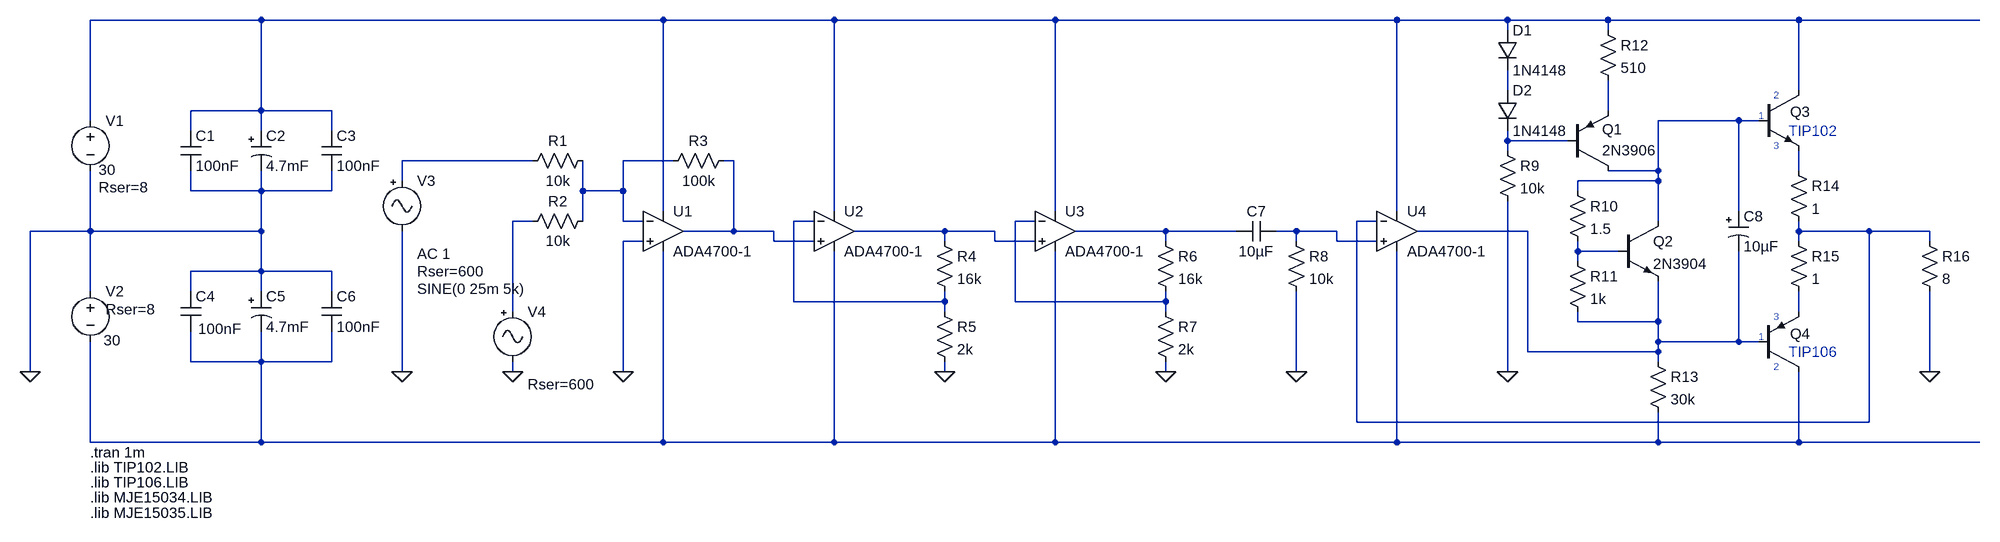
[diagram p0: schematic 30Vamp.asc]
30Vamp.asc, the LTspice schematic file:
Version 4
SHEET 1 3496 808
WIRE 464 -192 192 -192
WIRE 1104 -192 464 -192
WIRE 1376 -192 1104 -192
WIRE 1728 -192 1376 -192
WIRE 2272 -192 1728 -192
WIRE 2448 -192 2272 -192
WIRE 2608 -192 2448 -192
WIRE 2912 -192 2608 -192
WIRE 3200 -192 2912 -192
WIRE 2448 -176 2448 -192
WIRE 2608 -176 2608 -192
WIRE 2448 -80 2448 -112
WIRE 2912 -80 2912 -192
WIRE 464 -48 464 -192
WIRE 464 -48 352 -48
WIRE 576 -48 464 -48
WIRE 2608 -48 2608 -96
WIRE 192 -32 192 -192
WIRE 2816 -32 2688 -32
WIRE 2848 -32 2816 -32
WIRE 352 -16 352 -48
WIRE 464 -16 464 -48
WIRE 576 -16 576 -48
WIRE 2448 0 2448 -16
WIRE 2544 0 2448 0
WIRE 2448 16 2448 0
WIRE 896 32 688 32
WIRE 1120 32 1040 32
WIRE 1216 32 1200 32
WIRE 2688 48 2688 -32
WIRE 2688 48 2608 48
WIRE 2912 48 2912 16
WIRE 688 64 688 32
WIRE 2688 64 2688 48
WIRE 2688 64 2560 64
WIRE 352 80 352 48
WIRE 464 80 464 48
WIRE 464 80 352 80
WIRE 576 80 576 48
WIRE 576 80 464 80
WIRE 976 80 976 32
WIRE 1040 80 1040 32
WIRE 1040 80 976 80
WIRE 2560 80 2560 64
WIRE 1104 112 1104 -192
WIRE 1376 112 1376 -192
WIRE 1728 112 1728 -192
WIRE 2272 112 2272 -192
WIRE 2816 112 2816 -32
WIRE 896 128 864 128
WIRE 976 128 976 80
WIRE 1040 128 1040 80
WIRE 1072 128 1040 128
WIRE 1344 128 1312 128
WIRE 1696 128 1664 128
WIRE 2240 128 2208 128
WIRE 2688 128 2688 64
WIRE 192 144 192 48
WIRE 192 144 96 144
WIRE 464 144 464 80
WIRE 464 144 192 144
WIRE 1216 144 1216 32
WIRE 1216 144 1136 144
WIRE 1280 144 1216 144
WIRE 1552 144 1408 144
WIRE 1632 144 1552 144
WIRE 1904 144 1760 144
WIRE 2016 144 1904 144
WIRE 2112 144 2080 144
WIRE 2176 144 2112 144
WIRE 2480 144 2304 144
WIRE 2912 144 2912 128
WIRE 3024 144 2912 144
WIRE 3120 144 3024 144
WIRE 1072 160 1040 160
WIRE 1280 160 1280 144
WIRE 1344 160 1280 160
WIRE 1552 160 1552 144
WIRE 1632 160 1632 144
WIRE 1696 160 1632 160
WIRE 1904 160 1904 144
WIRE 2112 160 2112 144
WIRE 2176 160 2176 144
WIRE 2240 160 2176 160
WIRE 2912 160 2912 144
WIRE 3120 160 3120 144
WIRE 2560 176 2560 160
WIRE 2624 176 2560 176
WIRE 2560 192 2560 176
WIRE 464 208 464 144
WIRE 464 208 352 208
WIRE 576 208 464 208
WIRE 192 240 192 144
WIRE 352 240 352 208
WIRE 464 240 464 208
WIRE 576 240 576 208
WIRE 1312 256 1312 128
WIRE 1552 256 1552 240
WIRE 1552 256 1312 256
WIRE 1664 256 1664 128
WIRE 1904 256 1904 240
WIRE 1904 256 1664 256
WIRE 864 272 864 128
WIRE 1552 272 1552 256
WIRE 1904 272 1904 256
WIRE 2912 272 2912 240
WIRE 2560 288 2560 272
WIRE 2688 288 2688 224
WIRE 2688 288 2560 288
WIRE 2688 320 2688 288
WIRE 2816 320 2816 176
WIRE 2816 320 2688 320
WIRE 2848 320 2816 320
WIRE 2480 336 2480 144
WIRE 2688 336 2688 320
WIRE 2688 336 2480 336
WIRE 352 352 352 304
WIRE 464 352 464 304
WIRE 464 352 352 352
WIRE 576 352 576 304
WIRE 576 352 464 352
WIRE 2688 352 2688 336
WIRE 96 368 96 144
WIRE 688 368 688 144
WIRE 864 368 864 352
WIRE 1040 368 1040 160
WIRE 1552 368 1552 352
WIRE 1904 368 1904 352
WIRE 2112 368 2112 240
WIRE 2448 368 2448 96
WIRE 3120 368 3120 240
WIRE 2208 448 2208 128
WIRE 3024 448 3024 144
WIRE 3024 448 2208 448
WIRE 192 480 192 320
WIRE 464 480 464 352
WIRE 464 480 192 480
WIRE 1104 480 1104 176
WIRE 1104 480 464 480
WIRE 1376 480 1376 176
WIRE 1376 480 1104 480
WIRE 1728 480 1728 176
WIRE 1728 480 1376 480
WIRE 2272 480 2272 176
WIRE 2272 480 1728 480
WIRE 2688 480 2688 432
WIRE 2688 480 2272 480
WIRE 2912 480 2912 368
WIRE 2912 480 2688 480
WIRE 3200 480 2912 480
FLAG 1904 368 0
FLAG 1552 368 0
FLAG 2112 368 0
FLAG 864 368 0
FLAG 3120 368 0
FLAG 96 368 0
FLAG 2448 368 0
FLAG 1040 368 0
FLAG 688 368 0
SYMBOL voltage 192 -48 R0
WINDOW 3 13 94 Left 2
WINDOW 123 0 0 Left 0
WINDOW 39 13 122 Left 2
SYMATTR Value 30
SYMATTR SpiceLine Rser=8
SYMATTR InstName V1
SYMBOL voltage 192 224 R0
WINDOW 123 0 0 Left 0
WINDOW 39 24 44 Left 2
WINDOW 3 21 94 Left 2
SYMATTR SpiceLine Rser=8
SYMATTR Value 30
SYMATTR InstName V2
SYMBOL cap 336 -16 R0
SYMATTR InstName C1
SYMATTR Value 100nF
SYMBOL cap 560 -16 R0
SYMATTR InstName C3
SYMATTR Value 100nF
SYMBOL cap 336 240 R0
WINDOW 3 28 59 Left 2
SYMATTR Value 100nF
SYMATTR InstName C4
SYMBOL cap 560 240 R0
SYMATTR InstName C6
SYMATTR Value 100nF
SYMBOL polcap 448 -16 R0
SYMATTR InstName C2
SYMATTR Value 4.7mF
SYMBOL polcap 448 240 R0
SYMATTR InstName C5
SYMATTR Value 4.7mF
SYMBOL res 1536 144 R0
SYMATTR InstName R4
SYMATTR Value 16k
SYMBOL res 1536 256 R0
SYMATTR InstName R5
SYMATTR Value 2k
SYMBOL res 1888 144 R0
SYMATTR InstName R6
SYMATTR Value 16k
SYMBOL res 1888 256 R0
SYMATTR InstName R7
SYMATTR Value 2k
SYMBOL cap 2080 128 R90
WINDOW 0 0 32 VBottom 2
WINDOW 3 32 32 VTop 2
SYMATTR InstName C7
SYMATTR Value 10µF
SYMBOL npn 2848 -80 R0
WINDOW 0 50 34 Left 2
WINDOW 3 49 61 Left 2
SYMATTR InstName Q3
SYMATTR Value ""
SYMATTR SpiceModel Qmje15034
SYMBOL pnp 2848 368 M180
WINDOW 0 50 61 Left 2
WINDOW 3 50 34 Left 2
SYMATTR InstName Q4
SYMATTR Value ""
SYMATTR SpiceModel Qmje15035
SYMBOL res 2896 32 R0
SYMATTR InstName R14
SYMATTR Value 1
SYMATTR SpiceLine pwr=5
SYMBOL res 2896 144 R0
SYMATTR InstName R15
SYMATTR Value 1
SYMATTR SpiceLine pwr=5
SYMBOL res 3104 144 R0
SYMATTR InstName R16
SYMATTR Value 8
SYMATTR SpiceLine pwr=5
SYMBOL res 2096 144 R0
SYMATTR InstName R8
SYMATTR Value 10k
SYMBOL npn 2624 128 R0
SYMATTR InstName Q2
SYMATTR Value 2N3904
SYMBOL pnp 2544 48 M180
WINDOW 0 55 66 Left 2
WINDOW 3 55 33 Left 2
SYMATTR InstName Q1
SYMATTR Value 2N3906
SYMBOL res 2544 64 R0
SYMATTR InstName R10
SYMATTR Value 1.5
SYMBOL res 2544 176 R0
SYMATTR InstName R11
SYMATTR Value 1k
SYMBOL polcap 2800 112 R0
SYMATTR InstName C8
SYMATTR Value 10µF
SYMBOL res 2592 -192 R0
SYMATTR InstName R12
SYMATTR Value 510
SYMBOL diode 2432 -176 R0
SYMATTR InstName D1
SYMATTR Value 1N4148
SYMBOL res 2432 0 R0
SYMATTR InstName R9
SYMATTR Value 10k
SYMBOL res 992 16 R90
WINDOW 0 0 56 VBottom 2
WINDOW 3 32 56 VTop 2
SYMATTR InstName R1
SYMATTR Value 10k
SYMBOL res 992 112 R90
WINDOW 0 0 56 VBottom 2
WINDOW 3 32 56 VTop 2
SYMATTR InstName R2
SYMATTR Value 10k
SYMBOL res 1216 16 R90
WINDOW 0 0 56 VBottom 2
WINDOW 3 32 56 VTop 2
SYMATTR InstName R3
SYMATTR Value 100k
SYMBOL diode 2432 -80 R0
SYMATTR InstName D2
SYMATTR Value 1N4148
SYMBOL Misc\\signal 688 48 R0
WINDOW 123 24 132 Left 2
WINDOW 39 24 160 Left 2
WINDOW 3 24 188 Left 2
SYMATTR Value2 AC 1
SYMATTR SpiceLine Rser=600
SYMATTR Value SINE(0 25m 5k)
SYMATTR InstName V3
SYMBOL Misc\\signal 864 256 R0
WINDOW 123 0 0 Left 0
WINDOW 39 24 132 Left 2
WINDOW 3 24 44 Left 2
SYMATTR SpiceLine Rser=600
SYMATTR Value ""
SYMATTR InstName V4
SYMBOL Opamps\\ADA4700-1 1104 80 R0
SYMATTR InstName U1
SYMBOL Opamps\\ADA4700-1 1376 80 R0
SYMATTR InstName U2
SYMBOL Opamps\\ADA4700-1 1728 80 R0
SYMATTR InstName U3
SYMBOL Opamps\\ADA4700-1 2272 80 R0
SYMATTR InstName U4
SYMBOL res 2672 336 R0
SYMATTR InstName R13
SYMATTR Value 30k
TEXT 2848 -40 Left 1 ;1
TEXT 2872 -72 Left 1 ;2
TEXT 2872 8 Left 1 ;3
TEXT 2848 312 Left 1 ;1
TEXT 2872 280 Left 1 ;3
TEXT 2872 360 Left 1 ;2
TEXT 192 520 Left 2 !.lib TIP102.LIB
TEXT 192 544 Left 2 !.lib TIP106.LIB
TEXT 192 496 Left 2 !.tran 1m
TEXT 192 568 Left 2 !.lib MJE15034.LIB
TEXT 192 592 Left 2 !.lib MJE15035.LIB
TEXT 2896 -16 Left 2 ;TIP102
TEXT 2896 336 Left 2 ;TIP106

The netlist it stands for:
* 30Vamp.asc
V1 N001 0 30 Rser=8
V2 0 N020 30 Rser=8
C1 N001 0 100nF
C3 N001 0 100nF
C4 0 N020 100nF
C6 0 N020 100nF
C2 N001 0 4.7mF
C5 0 N020 4.7mF
R4 N014 N011 16k
R5 N011 0 2k
R6 N015 N012 16k
R7 N012 0 2k
C7 N016 N015 10µF
Q3 N001 N004 N009 0 Qmje15034
Q4 N020 N017 N019 0 Qmje15035
R14 N009 N013 1 pwr=5
R15 N013 N019 1 pwr=5
R16 N013 0 8 pwr=5
R8 N016 0 10k
Q2 N004 N018 N017 0 2N3904
Q1 N004 N005 N003 0 2N3906
R10 N004 N018 1.5
R11 N018 N017 1k
C8 N004 N017 10µF
R12 N001 N003 510
D1 N001 N002 1N4148
R9 N005 0 10k
R1 N007 N006 10k
R2 N007 N010 10k
R3 N008 N007 100k
D2 N002 N005 1N4148
V3 N006 0 SINE(0 25m 5k) AC 1 Rser=600
V4 N010 0 Rser=600
XU1 0 N007 N001 N020 N008 ADA4700-1  ; pins In+ In- V+ V- OUT
XU2 N008 N011 N001 N020 N014 ADA4700-1  ; pins In+ In- V+ V- OUT
XU3 N014 N012 N001 N020 N015 ADA4700-1  ; pins In+ In- V+ V- OUT
XU4 N016 N013 N001 N020 N017 ADA4700-1  ; pins In+ In- V+ V- OUT
R13 N017 N020 30k
.model D D
.lib standard.dio
.model NPN NPN
.model PNP PNP
.lib standard.bjt
* 1
* 2
* 3
* 1
* 3
* 2
.lib TIP102.LIB
.lib TIP106.LIB
.tran 1m
.lib MJE15034.LIB
.lib MJE15035.LIB
* TIP102
* TIP106
.lib ADI1.lib
.backanno
.end